# Altium project XPIMU_1V1.PrjPCB
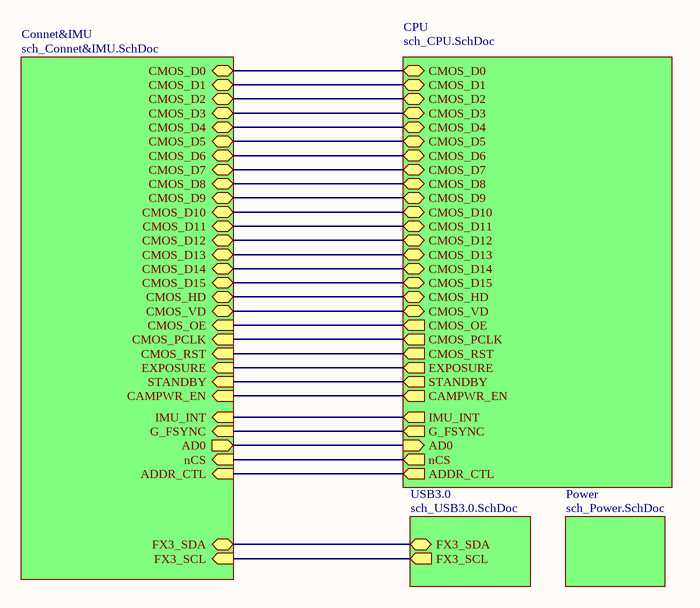
[diagram p0: sch_Top.SchDoc]
5 sheets, 137 parts. Net scope: hierarchical (ports join the sheet entries above them; power ports are global).
Sheets:
  sch_Top.SchDoc
    Connet&IMU = sch_Connet&IMU.SchDoc
    USB3.0 = sch_USB3.0.SchDoc
    CPU = sch_CPU.SchDoc
    Power = sch_Power.SchDoc

## Sheet sch_Top.SchDoc
size A4

### Sub-sheets
Connet&IMU = sch_Connet&IMU.SchDoc: FX3_SCL (in), AD0 (out), nCS (in), STANDBY (in), EXPOSURE (in), CMOS_OE (in), CAMPWR_EN (in), ADDR_CTL (in), CMOS_RST (in), FX3_SDA (bidir), CMOS_HD (bidir), CMOS_PCLK (in), CMOS_VD (bidir), CMOS_D0 (bidir), CMOS_D1 (bidir), CMOS_D2 (bidir), CMOS_D3 (bidir), CMOS_D4 (bidir), CMOS_D5 (bidir), CMOS_D6 (bidir), CMOS_D7 (bidir), CMOS_D8 (bidir), CMOS_D9 (bidir), CMOS_D10 (bidir), CMOS_D11 (bidir), CMOS_D12 (bidir), CMOS_D13 (bidir), CMOS_D14 (bidir), CMOS_D15 (bidir), IMU_INT (in), G_FSYNC (in)
CPU = sch_CPU.SchDoc: AD0 (in), ADDR_CTL (out), CAMPWR_EN (out), CMOS_D0 (bidir), CMOS_D1 (bidir), CMOS_D2 (bidir), CMOS_D3 (bidir), CMOS_D4 (bidir), CMOS_D5 (bidir), CMOS_D6 (bidir), CMOS_D7 (bidir), CMOS_D8 (bidir), CMOS_D9 (bidir), CMOS_D10 (bidir), CMOS_D11 (bidir), CMOS_D12 (bidir), CMOS_D13 (bidir), CMOS_D14 (bidir), CMOS_D15 (bidir), CMOS_HD (bidir), CMOS_VD (bidir), CMOS_OE (out), CMOS_PCLK (out), CMOS_RST (out), EXPOSURE (out), IMU_INT (out), G_FSYNC (out), STANDBY (out), nCS (out)
Power = sch_Power.SchDoc: no entries
USB3.0 = sch_USB3.0.SchDoc: FX3_SDA (bidir), FX3_SCL (out)

### Nets
AD0: sheet Connet&IMU/AD0, sheet CPU/AD0
ADDR_CTL: sheet Connet&IMU/ADDR_CTL, sheet CPU/ADDR_CTL
CAMPWR_EN: sheet Connet&IMU/CAMPWR_EN, sheet CPU/CAMPWR_EN
CMOS_D0: sheet Connet&IMU/CMOS_D0, sheet CPU/CMOS_D0
CMOS_D1: sheet Connet&IMU/CMOS_D1, sheet CPU/CMOS_D1
CMOS_D2: sheet Connet&IMU/CMOS_D2, sheet CPU/CMOS_D2
CMOS_D3: sheet Connet&IMU/CMOS_D3, sheet CPU/CMOS_D3
CMOS_D4: sheet Connet&IMU/CMOS_D4, sheet CPU/CMOS_D4
CMOS_D5: sheet Connet&IMU/CMOS_D5, sheet CPU/CMOS_D5
CMOS_D6: sheet Connet&IMU/CMOS_D6, sheet CPU/CMOS_D6
CMOS_D7: sheet Connet&IMU/CMOS_D7, sheet CPU/CMOS_D7
CMOS_D8: sheet Connet&IMU/CMOS_D8, sheet CPU/CMOS_D8
CMOS_D9: sheet Connet&IMU/CMOS_D9, sheet CPU/CMOS_D9
CMOS_D10: sheet Connet&IMU/CMOS_D10, sheet CPU/CMOS_D10
CMOS_D11: sheet Connet&IMU/CMOS_D11, sheet CPU/CMOS_D11
CMOS_D12: sheet Connet&IMU/CMOS_D12, sheet CPU/CMOS_D12
CMOS_D13: sheet Connet&IMU/CMOS_D13, sheet CPU/CMOS_D13
CMOS_D14: sheet Connet&IMU/CMOS_D14, sheet CPU/CMOS_D14
CMOS_D15: sheet Connet&IMU/CMOS_D15, sheet CPU/CMOS_D15
CMOS_HD: sheet Connet&IMU/CMOS_HD, sheet CPU/CMOS_HD
CMOS_OE: sheet Connet&IMU/CMOS_OE, sheet CPU/CMOS_OE
CMOS_PCLK: sheet Connet&IMU/CMOS_PCLK, sheet CPU/CMOS_PCLK
CMOS_RST: sheet Connet&IMU/CMOS_RST, sheet CPU/CMOS_RST
CMOS_VD: sheet Connet&IMU/CMOS_VD, sheet CPU/CMOS_VD
EXPOSURE: sheet Connet&IMU/EXPOSURE, sheet CPU/EXPOSURE
FX3_SCL: sheet Connet&IMU/FX3_SCL, sheet USB3.0/FX3_SCL
FX3_SDA: sheet Connet&IMU/FX3_SDA, sheet USB3.0/FX3_SDA
G_FSYNC: sheet Connet&IMU/G_FSYNC, sheet CPU/G_FSYNC
IMU_INT: sheet Connet&IMU/IMU_INT, sheet CPU/IMU_INT
nCS: sheet Connet&IMU/nCS, sheet CPU/nCS
STANDBY: sheet Connet&IMU/STANDBY, sheet CPU/STANDBY

## Sheet sch_Connet&IMU.SchDoc
size A4
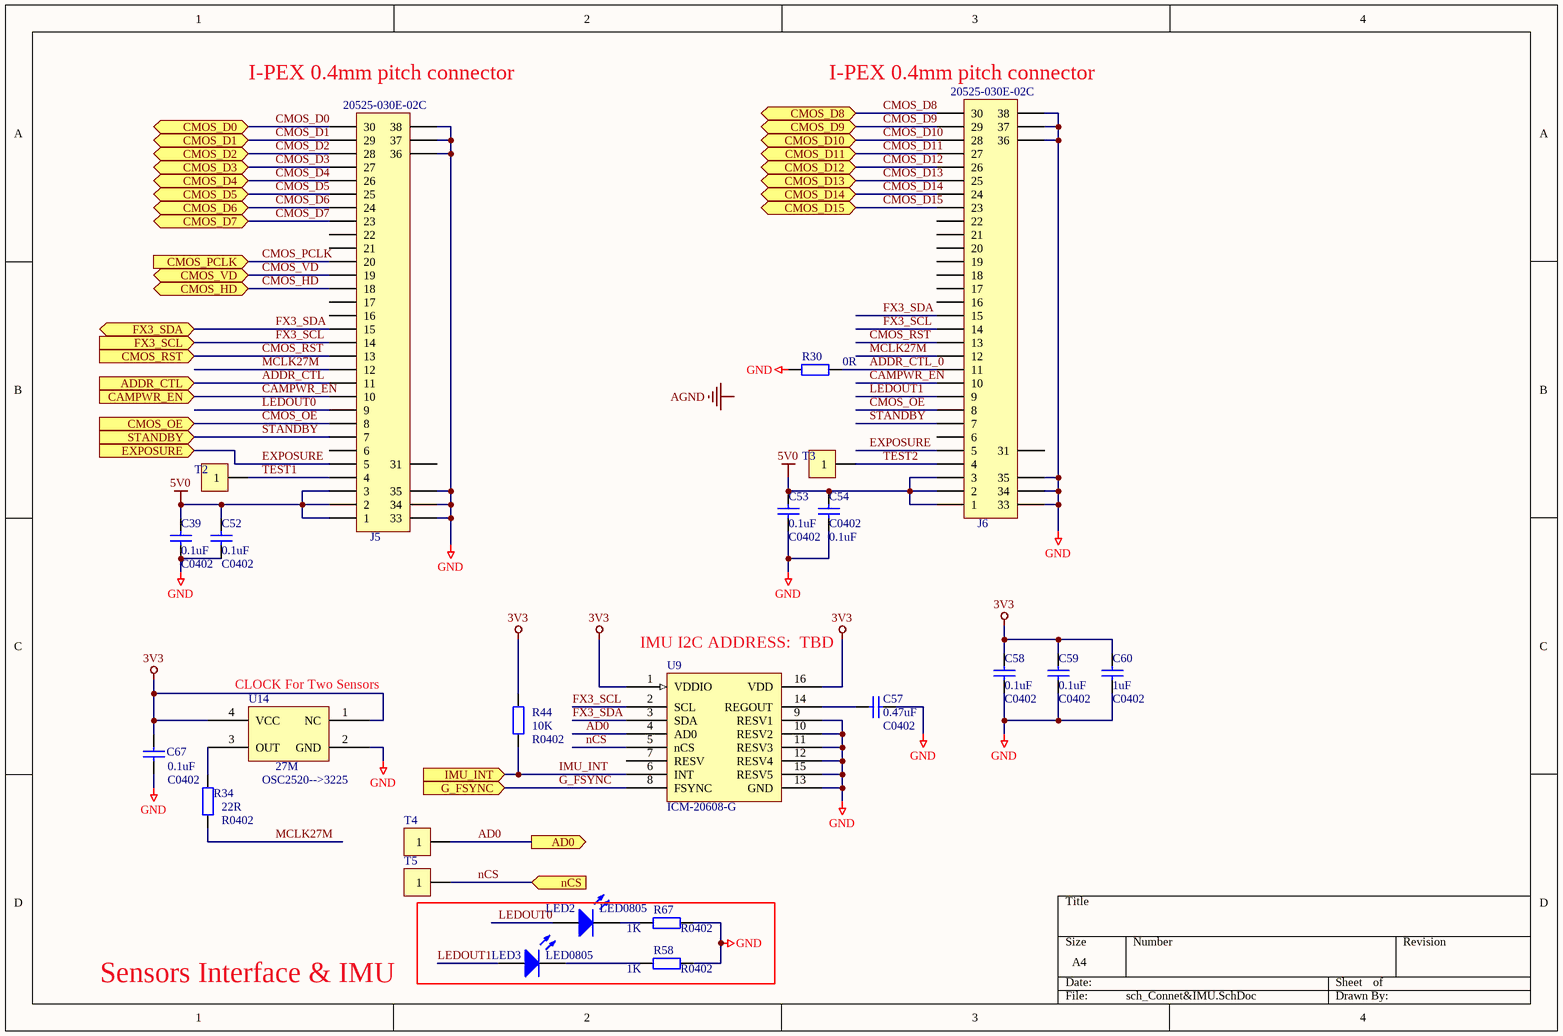
[diagram p1: sch_Connet&IMU.SchDoc]

### Parts
C39  0.1uF  value C0402  [0402C]
C52  0.1uF  value C0402  [0402C]
C53  0.1uF  value C0402  [0402C]
C54  0.1uF  value C0402  [0402C]
C57  0.47uF  value C0402  [0402C]
C58  0.1uF  value C0402  [0402C]
C59  0.1uF  value C0402  [0402C]
C60  1uF  value C0402  [0402C]
C67  0.1uF  value C0402  [0402C]
J5  20525-030E-02C  [HSA30_P40L196W42H10_20525]
J6  20525-030E-02C  [HSA30_P40L196W42H10_20525]
LED2  LED0805  [LED0805A_L210W100H60]
LED3  LED0805  [LED0805A_L210W100H60]
R30  0R  [0402R]
R34  22R  value R0402  [0402R]
R44  10K  value R0402  [0402R]
R58  1K  value R0402  [0402R]
R67  1K  value R0402  [0402R]
T2  CON1  [PAD_TP_D1.2]  (value not drawn)
T3  CON1  [PAD_TP_D1.2]  (value not drawn)
T4  CON1  [PAD_TP_D1.2]  (value not drawn)
T5  CON1  [PAD_TP_D1.2]  (value not drawn)
U9  ICM-20608-G  [LGA16_P50L30W30H08]
U14  OSC2520-->3225  [XTAL_3225]

### Ports
AD0 (out), ADDR_CTL (in), CAMPWR_EN (in), CMOS_D0 (bidir), CMOS_D1 (bidir), CMOS_D2 (bidir), CMOS_D3 (bidir), CMOS_D4 (bidir), CMOS_D5 (bidir), CMOS_D6 (bidir), CMOS_D7 (bidir), CMOS_D8 (bidir), CMOS_D9 (bidir), CMOS_D10 (bidir), CMOS_D11 (bidir), CMOS_D12 (bidir), CMOS_D13 (bidir), CMOS_D14 (bidir), CMOS_D15 (bidir), CMOS_HD (bidir), CMOS_OE (in), CMOS_PCLK (in), CMOS_RST (in), CMOS_VD (bidir), EXPOSURE (in), FX3_SCL (in), FX3_SDA (bidir), G_FSYNC (in), IMU_INT (in), nCS (in), STANDBY (in)

### Nets
3V3: C58.2 C59.2 C60.2 C67.2 R44.2 U9.1(VDDIO) U9.16(VDD) U14.1(NC) U14.4(VCC)
5V0: C39.2 C52.2 C53.2 C54.2 J5.1 J5.2 J5.3 J6.1 J6.2 J6.3
GND: C39.1 C52.1 C53.1 C54.1 C57.1 C58.1 C59.1 C60.1 C67.1 J5.33 J5.34 J5.35 J5.36 J5.37 J5.38 J6.33 J6.34 J6.35 J6.36 J6.37 J6.38 R30.2 R58.1 R67.1 U9.9(RESV1) U9.10(RESV2) U9.11(RESV3) U9.12(RESV4) U9.13(GND) U9.15(RESV5) U14.2(GND)
AD0: T4.1 U9.4(AD0) ; port AD0
ADDR_CTL: J5.11 ; port ADDR_CTL
ADDR_CTL_0: J6.11 R30.1
CAMPWR_EN: J5.10 J6.10 ; port CAMPWR_EN
CMOS_D0: J5.30 ; port CMOS_D0
CMOS_D1: J5.29 ; port CMOS_D1
CMOS_D2: J5.28 ; port CMOS_D2
CMOS_D3: J5.27 ; port CMOS_D3
CMOS_D4: J5.26 ; port CMOS_D4
CMOS_D5: J5.25 ; port CMOS_D5
CMOS_D6: J5.24 ; port CMOS_D6
CMOS_D7: J5.23 ; port CMOS_D7
CMOS_D8: J6.30 ; port CMOS_D8
CMOS_D9: J6.29 ; port CMOS_D9
CMOS_D10: J6.28 ; port CMOS_D10
CMOS_D11: J6.27 ; port CMOS_D11
CMOS_D12: J6.26 ; port CMOS_D12
CMOS_D13: J6.25 ; port CMOS_D13
CMOS_D14: J6.24 ; port CMOS_D14
CMOS_D15: J6.23 ; port CMOS_D15
CMOS_HD: J5.18 ; port CMOS_HD
CMOS_OE: J5.8 J6.8 ; port CMOS_OE
CMOS_PCLK: J5.20 ; port CMOS_PCLK
CMOS_RST: J5.13 J6.13 ; port CMOS_RST
CMOS_VD: J5.19 ; port CMOS_VD
EXPOSURE: J5.5 J6.5 ; port EXPOSURE
FX3_SCL: J5.14 J6.14 U9.2(SCL) ; port FX3_SCL
FX3_SDA: J5.15 J6.15 U9.3(SDA) ; port FX3_SDA
G_FSYNC: U9.8(FSYNC) ; port G_FSYNC
IMU_INT: R44.1 U9.6(INT) ; port IMU_INT
LEDOUT0: J5.9 LED2.1(A)
LEDOUT1: J6.9 LED3.1(A)
MCLK27M: J5.12 J6.12 R34.1
nCS: T5.1 U9.5(nCS) ; port nCS
STANDBY: J5.7 J6.7 ; port STANDBY
TEST1: J5.4 T2.1
TEST2: J6.4 T3.1
NetC57_2: C57.2 U9.14(REGOUT)
NetLED2_2: LED2.2(K) R67.2
NetLED3_2: LED3.2(K) R58.2
NetR34_2: R34.2 U14.3(OUT)

Not connected (* = marked no-connect by the designer): J5 6 16 17 21 22 31; J6 6 16 17 18 19 20 21 22 31; U9 7(RESV)

### Notes on the sheet
- (near J5) I-PEX 0.4mm pitch connector
- (near J6) I-PEX 0.4mm pitch connector
- (near U9) IMU I2C ADDRESS:  TBD
- (near U14) CLOCK For Two Sensors
- (near U14) 27M
- Sensors Interface & IMU
- Labels drawn without touching a wire or pin: AGND

### Library data of the parts
C39 C52-C54 C57-C60 C67 = Cap: Capacitor; Published: 8-Jun-2000; LatestRevisionDate: 17-Jul-2002; LatestRevisionNote: Re-released for DXP Platform.; PackageReference: RAD-0.3; Publisher: Altium Limited
LED2 LED3 = LED: 发光二级管
R30 R34 R44 R58 R67 = Res2: Resistor; Published: 8-Jun-2000; LatestRevisionDate: 17-Jul-2002; LatestRevisionNote: Re-released for DXP Platform.; PackageReference: AXIAL-0.4; Publisher: Altium Limited
  R30: Value: 0R
T2-T5 = CON1: Connector
U14 = XTAL-SPXO: Simple Package Xtal Oscillator

## Sheet sch_USB3.0.SchDoc
size A4
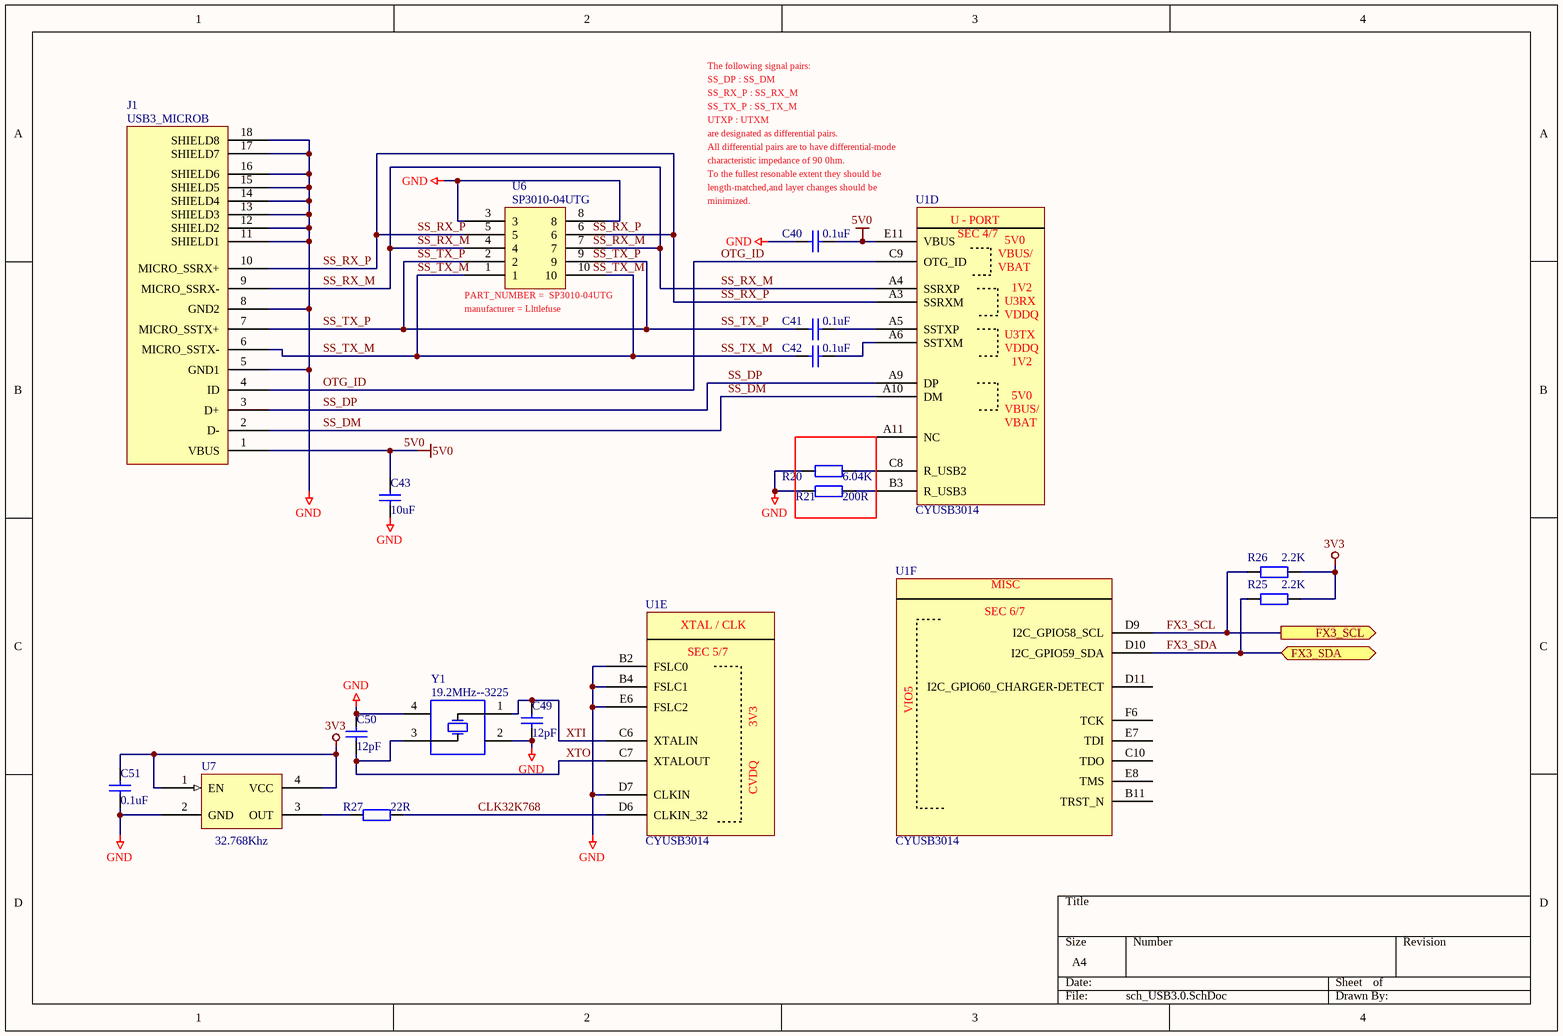
[diagram p2: sch_USB3.0.SchDoc]

### Parts
C40  0.1uF  [0402C]
C41  0.1uF  [0402C]
C42  0.1uF  [0402C]
C43  10uF  [0805C]
C49  12pF  [0402C]
C50  12pF  [0402C]
C51  0.1uF  [0402C]
J1  USB3_MICROB  [USB3_BA_P65L130W51H28]
R20  6.04K  [0402R]
R21  200R  [0402R]
R25  2.2K  [0402R]
R26  2.2K  [0402R]
R27  22R  [0402R]
U1  CYUSB3014  [FBGA121_P80L100W100H11]  (parts D,E,F of 7)
U6  SP3010-04UTG  [UDFN10_SON_P50L25W10H55]
U7  XTAL-3225  [XTAL_3225]  (value not drawn)
Y1  19.2MHz--3225  [XTAL_3225]

### Ports
FX3_SCL (out), FX3_SDA (bidir)

### Nets
3V3: C51.2 R25.1 R26.1 U7.1(EN) U7.4(VCC)
5V0: C40.1 C43.2 J1.1(VBUS) U1.E11(VBUS)
GND: C40.2 C43.1 C49.1 C50.2 C51.1 J1.5(GND1) J1.8(GND2) J1.11(SHIELD1) J1.12(SHIELD2) J1.13(SHIELD3) J1.14(SHIELD4) J1.15(SHIELD5) J1.16(SHIELD6) J1.17(SHIELD7) J1.18(SHIELD8) R20.2 R21.2 U1.B2(FSLC0) U1.B4(FSLC1) U1.D7(CLKIN) U1.E6(FSLC2) U6.3 U6.8 U7.2(GND) Y1.2 Y1.4
CLK32K768: R27.1 U1.D6(CLKIN_32)
FX3_SCL: R26.2 U1.D9(I2C_GPIO58_SCL) ; port FX3_SCL
FX3_SDA: R25.2 U1.D10(I2C_GPIO59_SDA) ; port FX3_SDA
OTG_ID: J1.4(ID) U1.C9(OTG_ID)
SS_DM: J1.2(D-) U1.A10(DM)
SS_DP: J1.3(D+) U1.A9(DP)
SS_RX_M: J1.9(MICRO_SSRX-) U1.A4(SSRXP) U6.4 U6.7
SS_RX_P: J1.10(MICRO_SSRX+) U1.A3(SSRXM) U6.5 U6.6
SS_TX_M: C42.2 J1.6(MICRO_SSTX-) U6.1 U6.10
SS_TX_P: C41.2 J1.7(MICRO_SSTX+) U6.2 U6.9
XTI: C49.2 U1.C6(XTALIN) Y1.1
XTO: C50.1 U1.C7(XTALOUT) Y1.3
NetC41_1: C41.1 U1.A5(SSTXP)
NetC42_1: C42.1 U1.A6(SSTXM)
NetR20_1: R20.1 U1.C8(R_USB2)
NetR21_1: R21.1 U1.B3(R_USB3)
NetR27_2: R27.2 U7.3(OUT)

Not connected (* = marked no-connect by the designer): U1 A11(NC) B11(TRST_N) C10(TDO) D11(I2C_GPIO60_CHARGER-DETECT) E7(TDI) E8(TMS) F6(TCK)

### Notes on the sheet
- The following signal pairs:
- SS_DP : SS_DM
- SS_RX_P : SS_RX_M
- SS_TX_P : SS_TX_M
- UTXP : UTXM
- are designated as differential pairs.
- All differential pairs are to have differential-mode
- characteristic impedance of 90 0hm.
- To the fullest resonable extent they should be
- length-matched,and layer changes should be
- minimized.
- (near U6) PART_NUMBER =  SP3010-04UTG
- (near U6) manufacturer = Llttlefuse
- (near U7) 32.768Khz
- Labels drawn without touching a wire or pin: SS_RX_M, SS_RX_P, SS_TX_M, SS_TX_P
- (in symbol CYUSB3014, part D) U - PORT; SEC 4/7; 5V0; VBUS/; 1V2; U3RX; VDDQ; U3TX
- (in symbol CYUSB3014, part E) XTAL / CLK; SEC 5/7; 3V3; CVDQ
- (in symbol CYUSB3014, part F) MISC; SEC 6/7

### Library data of the parts
C40-C43 C49-C51 = Cap: Capacitor; Published: 8-Jun-2000; LatestRevisionDate: 17-Jul-2002; LatestRevisionNote: Re-released for DXP Platform.; PackageReference: RAD-0.3; Publisher: Altium Limited
  C40-C42 C51: Value: 0.1uF
  C43: Value: 10uF
R20 = Resistor: Value: 43; Published: 8-Jun-2000; LatestRevisionDate: 17-Jul-2002; LatestRevisionNote: Re-released for DXP Platform.; PackageReference: AXIAL-0.4; Publisher: Altium Limited
R21 R25-R27 = Resistor: Published: 8-Jun-2000; LatestRevisionDate: 17-Jul-2002; LatestRevisionNote: Re-released for DXP Platform.; PackageReference: AXIAL-0.4; Publisher: Altium Limited
U7 = XTAL.
Y1 = XTAL: Crystal Oscillator

## Sheet sch_CPU.SchDoc
size A4
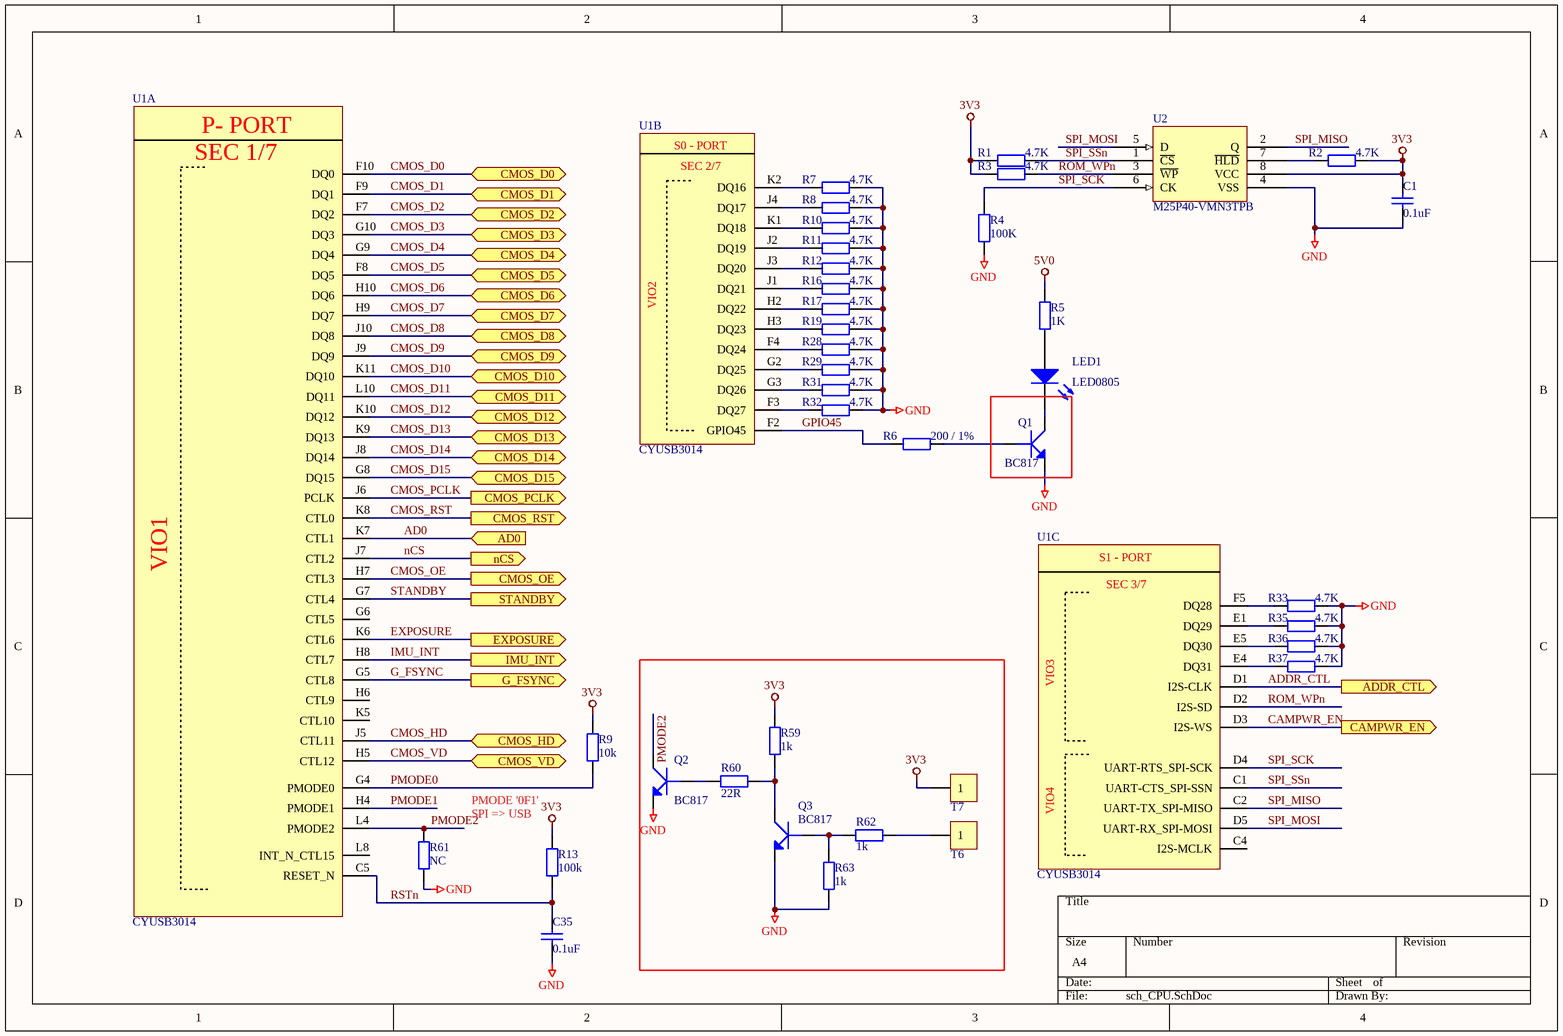
[diagram p3: sch_CPU.SchDoc]

### Parts
C1  0.1uF  [0402C]
C35  0.1uF  [0402C]
LED1  LED0805  [LED0805A_L210W100H60]
Q1  BC817  [SOT-23L]
Q2  BC817  [SOT-23L]
Q3  BC817  [SOT-23L]
R1  4.7K  [0402R]
R2  4.7K  [0402R]
R3  4.7K  [0402R]
R4  100K  [0402R]
R5  1K  [0402R]
R6  value 200 / 1%  [0402R]  (hidden comment: 200R)
R7  4.7K  [0402R]
R8  4.7K  [0402R]
R9  10K  [0402R]
R10  4.7K  [0402R]
R11  4.7K  [0402R]
R12  4.7K  [0402R]
R13  100K  [0402R]
R16  4.7K  [0402R]
R17  4.7K  [0402R]
R19  4.7K  [0402R]
R28  4.7K  [0402R]
R29  4.7K  [0402R]
R31  4.7K  [0402R]
R32  4.7K  [0402R]
R33  4.7K  [0402R]
R35  4.7K  [0402R]
R36  4.7K  [0402R]
R37  4.7K  [0402R]
R59  1K  [0402R]
R60  22R  [0402R]
R61  NC  [0805R]
R62  1k  [0402R]
R63  1k  [0402R]
T6  CON1  [PAD_TP_D1.2]  (value not drawn)
T7  CON1  [PAD_TP_D1.2]  (value not drawn)
U1  CYUSB3014  [FBGA121_P80L100W100H11]  (parts A,B,C of 7)
U2  M25P40-VMN3TPB  [SO8N_P127L50W40W62H17]

### Ports
AD0 (in), ADDR_CTL (out), CAMPWR_EN (out), CMOS_D0 (bidir), CMOS_D1 (bidir), CMOS_D2 (bidir), CMOS_D3 (bidir), CMOS_D4 (bidir), CMOS_D5 (bidir), CMOS_D6 (bidir), CMOS_D7 (bidir), CMOS_D8 (bidir), CMOS_D9 (bidir), CMOS_D10 (bidir), CMOS_D11 (bidir), CMOS_D12 (bidir), CMOS_D13 (bidir), CMOS_D14 (bidir), CMOS_D15 (bidir), CMOS_HD (bidir), CMOS_OE (out), CMOS_PCLK (out), CMOS_RST (out), CMOS_VD (bidir), EXPOSURE (out), G_FSYNC (out), IMU_INT (out), nCS (out), STANDBY (out)

### Nets
3V3: C1.2 R1.1 R2.2 R3.1 R9.1 R13.1 R59.2 T7.1 U2.8(VCC)
5V0: R5.1
GND: C1.1 C35.1 Q1.2(E) Q2.2(E) Q3.2(E) R4.1 R7.2 R8.2 R10.2 R11.2 R12.2 R16.2 R17.2 R19.2 R28.2 R29.2 R31.2 R32.2 R33.2 R35.2 R36.2 R37.2 R61.1 R63.2 U2.4(VSS)
AD0: U1.K7(CTL1) ; port AD0
ADDR_CTL: U1.D1(I2S-CLK) ; port ADDR_CTL
CAMPWR_EN: U1.D3(I2S-WS) ; port CAMPWR_EN
CMOS_D0: U1.F10(DQ0) ; port CMOS_D0
CMOS_D1: U1.F9(DQ1) ; port CMOS_D1
CMOS_D2: U1.F7(DQ2) ; port CMOS_D2
CMOS_D3: U1.G10(DQ3) ; port CMOS_D3
CMOS_D4: U1.G9(DQ4) ; port CMOS_D4
CMOS_D5: U1.F8(DQ5) ; port CMOS_D5
CMOS_D6: U1.H10(DQ6) ; port CMOS_D6
CMOS_D7: U1.H9(DQ7) ; port CMOS_D7
CMOS_D8: U1.J10(DQ8) ; port CMOS_D8
CMOS_D9: U1.J9(DQ9) ; port CMOS_D9
CMOS_D10: U1.K11(DQ10) ; port CMOS_D10
CMOS_D11: U1.L10(DQ11) ; port CMOS_D11
CMOS_D12: U1.K10(DQ12) ; port CMOS_D12
CMOS_D13: U1.K9(DQ13) ; port CMOS_D13
CMOS_D14: U1.J8(DQ14) ; port CMOS_D14
CMOS_D15: U1.G8(DQ15) ; port CMOS_D15
CMOS_HD: U1.J5(CTL11) ; port CMOS_HD
CMOS_OE: U1.H7(CTL3) ; port CMOS_OE
CMOS_PCLK: U1.J6(PCLK) ; port CMOS_PCLK
CMOS_RST: U1.K8(CTL0) ; port CMOS_RST
CMOS_VD: U1.H5(CTL12) ; port CMOS_VD
EXPOSURE: U1.K6(CTL6) ; port EXPOSURE
G_FSYNC: U1.G5(CTL8) ; port G_FSYNC
GPIO45: R6.1 U1.F2(GPIO45)
IMU_INT: U1.H8(CTL7) ; port IMU_INT
nCS: U1.J7(CTL2) ; port nCS
PMODE0: R9.2 U1.G4(PMODE0)
PMODE1: U1.H4(PMODE1)
PMODE2: Q2.3(C) R61.2 U1.L4(PMODE2)
ROM_WPn: R3.2 U1.D2(I2S-SD) U2.3(~{WP})
RSTn: C35.2 R13.2 U1.C5(RESET_N)
SPI_MISO: U1.C2(UART-TX_SPI-MISO) U2.2(Q)
SPI_MOSI: U1.D5(UART-RX_SPI-MOSI) U2.5(D)
SPI_SCK: R4.2 U1.D4(UART-RTS_SPI-SCK) U2.6(CK)
SPI_SSn: R1.2 U1.C1(UART-CTS_SPI-SSN) U2.1(~{CS})
STANDBY: U1.G7(CTL4) ; port STANDBY
NetLED1_1: LED1.1(A) R5.2
NetLED1_2: LED1.2(K) Q1.3(C)
NetQ1_1: Q1.1(B) R6.2
NetQ2_1: Q2.1(B) R60.1
NetQ3_1: Q3.1(B) R62.2 R63.1
NetQ3_3: Q3.3(C) R59.1 R60.2
NetR2_1: R2.1 U2.7(~{HLD})
NetR7_1: R7.1 U1.K2(DQ16)
NetR8_1: R8.1 U1.J4(DQ17)
NetR10_1: R10.1 U1.K1(DQ18)
NetR11_1: R11.1 U1.J2(DQ19)
NetR12_1: R12.1 U1.J3(DQ20)
NetR16_1: R16.1 U1.J1(DQ21)
NetR17_1: R17.1 U1.H2(DQ22)
NetR19_1: R19.1 U1.H3(DQ23)
NetR28_1: R28.1 U1.F4(DQ24)
NetR29_1: R29.1 U1.G2(DQ25)
NetR31_1: R31.1 U1.G3(DQ26)
NetR32_1: R32.1 U1.F3(DQ27)
NetR33_1: R33.1 U1.F5(DQ28)
NetR35_1: R35.1 U1.E1(DQ29)
NetR36_1: R36.1 U1.E5(DQ30)
NetR37_1: R37.1 U1.E4(DQ31)
NetR62_1: R62.1 T6.1

Not connected (* = marked no-connect by the designer): U1 C4(I2S-MCLK) G6(CTL5) H6(CTL9) K5(CTL10) L8(INT_N_CTL15)

### Notes on the sheet
- PMODE '0F1'
- SPI => USB
- (in symbol CYUSB3014, part A) P- PORT; SEC 1/7; VIO1
- (in symbol CYUSB3014, part B) S0 - PORT; SEC 2/7
- (in symbol CYUSB3014, part C) S1 - PORT; SEC 3/7

### Library data of the parts
C1 C35 = Cap: Capacitor; Published: 8-Jun-2000; LatestRevisionDate: 17-Jul-2002; LatestRevisionNote: Re-released for DXP Platform.; PackageReference: RAD-0.3; Publisher: Altium Limited; Value: 0.1uF
LED1 = LED: 发光二级管
Q1-Q3 = NPN: NPN Transistor
R1-R13 R16 R17 R19 R28 R29 R31-R33 R35-R37 R59 R61-R63 = Resistor: Published: 8-Jun-2000; LatestRevisionDate: 17-Jul-2002; LatestRevisionNote: Re-released for DXP Platform.; PackageReference: AXIAL-0.4; Publisher: Altium Limited
  R1-R3 R7 R8 R10-R12 R16 R17 R19 R28 R29 R31-R33 R35-R37: Value: 4.7K
  R4: Value: 100K
  R5: Value: 1K
  R9: Value: 10k
  R13: Value: 100k
  R59 R62 R63: Value: 1k
  R61: Value: NC
R60 = Resistor: Value: 10k; Published: 8-Jun-2000; LatestRevisionDate: 17-Jul-2002; LatestRevisionNote: Re-released for DXP Platform.; PackageReference: AXIAL-0.4; Publisher: Altium Limited
T6 T7 = CON1: Connector

## Sheet sch_Power.SchDoc
size A4
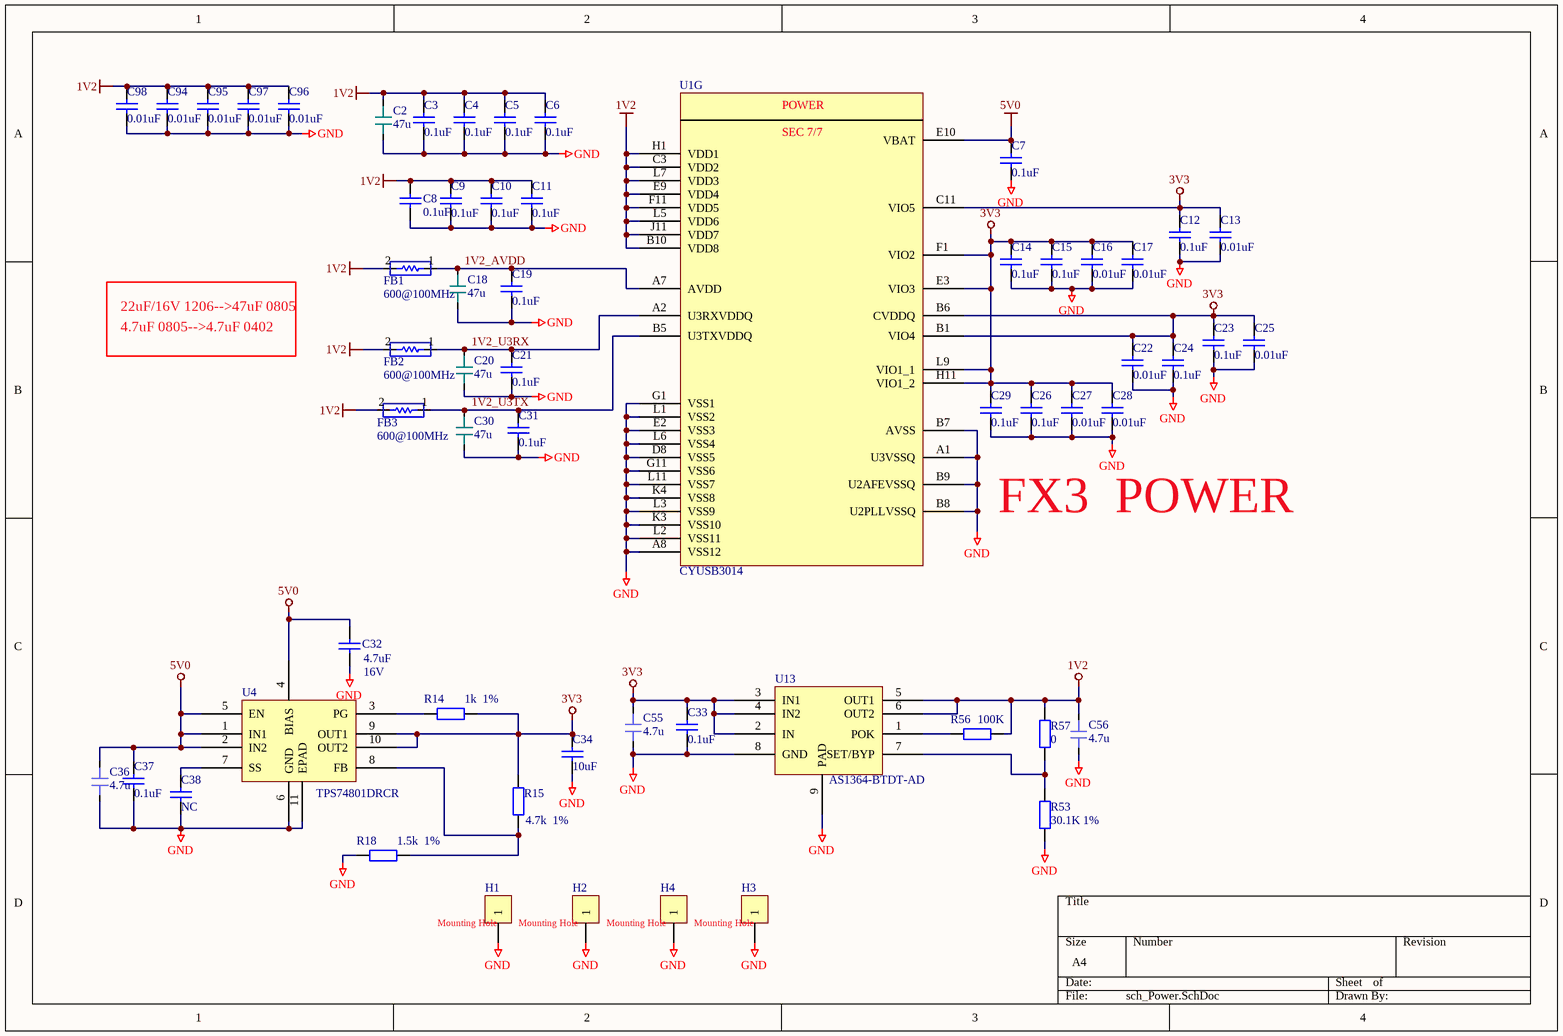
[diagram p4: sch_Power.SchDoc]

### Parts
C2  47u  [0805C]
C3  0.1uF  [0402C]
C4  0.1uF  [0402C]
C5  0.1uF  [0402C]
C6  0.1uF  [0402C]
C7  0.1uF  [0402C]
C8  0.1uF  [0402C]
C9  0.1uF  [0402C]
C10  0.1uF  [0402C]
C11  0.1uF  [0402C]
C12  0.1uF  [0402C]
C13  0.01uF  [0402C]
C14  0.1uF  [0402C]
C15  0.1uF  [0402C]
C16  0.01uF  [0402C]
C17  0.01uF  [0402C]
C18  47u  [0805C]
C19  0.1uF  [0402C]
C20  47u  [0805C]
C21  0.1uF  [0402C]
C22  0.01uF  [0402C]
C23  0.1uF  [0402C]
C24  0.1uF  [0402C]
C25  0.01uF  [0402C]
C26  0.1uF  [0402C]
C27  0.01uF  [0402C]
C28  0.01uF  [0402C]
C29  0.1uF  [0402C]
C30  47u  [0805C]
C31  0.1uF  [0402C]
C32  4.7uF  value 16V  [0805C]
C33  0.1uF  [0402C]
C34  10uF  [0805C]
C36  4.7u  [0402C]
C37  0.1uF  [0402C]
C38  NC  [0402C]
C55  4.7u  [0402C]
C56  4.7u  [0402C]
C94  0.01uF  [0402C]
C95  0.01uF  [0402C]
C96  0.01uF  [0402C]
C97  0.01uF  [0402C]
C98  0.01uF  [0402C]
FB1  600@100MHz  [0402R]
FB2  600@100MHz  [0402R]
FB3  600@100MHz  [0402R]
H1  CON1  [PAD_M3_D350_450]  (value not drawn)
H2  CON1  [PAD_M3_D350_450]  (value not drawn)
H3  CON1  [PAD_M3_D350_450]  (value not drawn)
H4  CON1  [PAD_M3_D350_450]  (value not drawn)
R14  value 1k  1%  [0402R]  (hidden comment: 1K)
R15  value 4.7k  1%  [0402R]  (hidden comment: 51K)
R18  value 1.5k  1%  [0402R]  (hidden comment: 1.15K)
R53  value 30.1K 1%  [0402R]  (hidden comment: 30.1K)
R56  100K  [0402R]
R57  value 0  [0402R]  (hidden comment: 0R)
U1  CYUSB3014  [FBGA121_P80L100W100H11]  (part G of 7)
U4  TPS74801DRCR  [SON10_P50L32W32H10_DRC]
U13  AS1364-BTDT-AD  [TDFN8_P65L30W30H08]

### Nets
1V2: C2.1 C3.2 C4.2 C5.2 C6.2 C8.2 C9.2 C10.2 C11.2 C56.1 C94.2 C95.2 C96.2 C97.2 C98.2 FB1.2 FB2.2 FB3.2 R56.1 R57.1 U1.B10(VDD8) U1.C3(VDD2) U1.E9(VDD4) U1.F11(VDD5) U1.H1(VDD1) U1.J11(VDD7) U1.L5(VDD6) U1.L7(VDD3) U13.5(OUT1) U13.6(OUT2)
3V3: C12.2 C13.2 C14.2 C15.2 C16.2 C17.2 C22.2 C23.2 C24.2 C25.2 C26.2 C27.2 C28.2 C29.2 C33.2 C34.2 C55.1 R14.1 R15.1 U1.B1(VIO4) U1.B6(CVDDQ) U1.C11(VIO5) U1.E3(VIO3) U1.F1(VIO2) U1.H11(VIO1_2) U1.L9(VIO1_1) U4.9(OUT1) U4.10(OUT2) U13.2(IN) U13.3(IN1) U13.4(IN2)
5V0: C7.2 C32.1 C36.1 C37.2 U1.E10(VBAT) U4.1(IN1) U4.2(IN2) U4.4(BIAS) U4.5(EN)
GND: C2.2 C3.1 C4.1 C5.1 C6.1 C7.1 C8.1 C9.1 C10.1 C11.1 C12.1 C13.1 C14.1 C15.1 C16.1 C17.1 C18.2 C19.1 C20.2 C21.1 C22.1 C23.1 C24.1 C25.1 C26.1 C27.1 C28.1 C29.1 C30.2 C31.1 C32.2 C33.1 C34.1 C36.2 C37.1 C38.1 C55.2 C56.2 C94.1 C95.1 C96.1 C97.1 C98.1 H1.1 H2.1 H3.1 H4.1 R18.2 R53.2 U1.A1(U3VSSQ) U1.A8(VSS12) U1.B7(AVSS) U1.B8(U2PLLVSSQ) U1.B9(U2AFEVSSQ) U1.D8(VSS5) U1.E2(VSS3) U1.G1(VSS1) U1.G11(VSS6) U1.K3(VSS10) U1.K4(VSS8) U1.L1(VSS2) U1.L2(VSS11) U1.L3(VSS9) U1.L6(VSS4) U1.L11(VSS7) U4.6(GND) U4.11(EPAD) U13.8(GND) U13.9(PAD)
1V2_AVDD: C18.1 C19.2 FB1.1 U1.A7(AVDD)
1V2_U3RX: C20.1 C21.2 FB2.1 U1.A2(U3RXVDDQ)
1V2_U3TX: C30.1 C31.2 FB3.1 U1.B5(U3TXVDDQ)
NetC38_2: C38.2 U4.7(SS)
NetR14_2: R14.2 U4.3(PG)
NetR15_2: R15.2 R18.1 U4.8(FB)
NetR53_1: R53.1 R57.2 U13.7(SET/BYP)
NetR56_2: R56.2 U13.1(POK)

### Notes on the sheet
- 22uF/16V 1206-->47uF 0805
- 4.7uF 0805-->4.7uF 0402
- FX3  POWER
- (near H1) Mounting Hole
- (near H2) Mounting Hole
- (near H4) Mounting Hole
- (near H3) Mounting Hole
- (in symbol CYUSB3014, part G) POWER; SEC 7/7

### Library data of the parts
C2 C18 C20 C30 = cap0805: CC08052B476M5B20D; 元件类别: 贴片电容; 主物料厂家: YAGEO
C3-C17 C19 C21-C29 C31-C34 C37 C38 C94-C98 = Cap: Capacitor; Published: 8-Jun-2000; LatestRevisionDate: 17-Jul-2002; LatestRevisionNote: Re-released for DXP Platform.; PackageReference: RAD-0.3; Publisher: Altium Limited
  C3-C12 C14 C15 C19 C21 C23 C24 C26 C29 C31 C33 C37: Value: 0.1uF
  C13 C16 C17 C22 C25 C27 C28 C94-C98: Value: 0.01uF
  C34: Value: 10uF
  C38: Value: NC
C36 C55 C56 = cap0402: CC0402MRX5R5BB475; 元件类别: 贴片电容; 主物料厂家: YAGEO
H1-H4 = CON1: Connector
R14 R15 R18 R53 R56 R57 = Resistor: Published: 8-Jun-2000; LatestRevisionDate: 17-Jul-2002; LatestRevisionNote: Re-released for DXP Platform.; PackageReference: AXIAL-0.4; Publisher: Altium Limited
  R56: Value: 100K

## Nets that join several sheets
3V3: sch_Connet&IMU (9 pins), sch_USB3.0 (5 pins), sch_CPU (9 pins), sch_Power (31 pins)
5V0: sch_Connet&IMU (10 pins), sch_USB3.0 (C40.1 C43.2 J1.1 U1.E11), sch_CPU (R5.1), sch_Power (9 pins)
GND: sch_Connet&IMU (31 pins), sch_USB3.0 (26 pins), sch_CPU (25 pins), sch_Power (69 pins)
AD0: sch_Connet&IMU (T4.1 U9.4), sch_CPU (U1.K7)
ADDR_CTL: sch_Connet&IMU (J5.11), sch_CPU (U1.D1)
CAMPWR_EN: sch_Connet&IMU (J5.10 J6.10), sch_CPU (U1.D3)
CMOS_D0: sch_Connet&IMU (J5.30), sch_CPU (U1.F10)
CMOS_D1: sch_Connet&IMU (J5.29), sch_CPU (U1.F9)
CMOS_D2: sch_Connet&IMU (J5.28), sch_CPU (U1.F7)
CMOS_D3: sch_Connet&IMU (J5.27), sch_CPU (U1.G10)
CMOS_D4: sch_Connet&IMU (J5.26), sch_CPU (U1.G9)
CMOS_D5: sch_Connet&IMU (J5.25), sch_CPU (U1.F8)
CMOS_D6: sch_Connet&IMU (J5.24), sch_CPU (U1.H10)
CMOS_D7: sch_Connet&IMU (J5.23), sch_CPU (U1.H9)
CMOS_D8: sch_Connet&IMU (J6.30), sch_CPU (U1.J10)
CMOS_D9: sch_Connet&IMU (J6.29), sch_CPU (U1.J9)
CMOS_D10: sch_Connet&IMU (J6.28), sch_CPU (U1.K11)
CMOS_D11: sch_Connet&IMU (J6.27), sch_CPU (U1.L10)
CMOS_D12: sch_Connet&IMU (J6.26), sch_CPU (U1.K10)
CMOS_D13: sch_Connet&IMU (J6.25), sch_CPU (U1.K9)
CMOS_D14: sch_Connet&IMU (J6.24), sch_CPU (U1.J8)
CMOS_D15: sch_Connet&IMU (J6.23), sch_CPU (U1.G8)
CMOS_HD: sch_Connet&IMU (J5.18), sch_CPU (U1.J5)
CMOS_OE: sch_Connet&IMU (J5.8 J6.8), sch_CPU (U1.H7)
CMOS_PCLK: sch_Connet&IMU (J5.20), sch_CPU (U1.J6)
CMOS_RST: sch_Connet&IMU (J5.13 J6.13), sch_CPU (U1.K8)
CMOS_VD: sch_Connet&IMU (J5.19), sch_CPU (U1.H5)
EXPOSURE: sch_Connet&IMU (J5.5 J6.5), sch_CPU (U1.K6)
FX3_SCL: sch_Connet&IMU (J5.14 J6.14 U9.2), sch_USB3.0 (R26.2 U1.D9)
FX3_SDA: sch_Connet&IMU (J5.15 J6.15 U9.3), sch_USB3.0 (R25.2 U1.D10)
G_FSYNC: sch_Connet&IMU (U9.8), sch_CPU (U1.G5)
IMU_INT: sch_Connet&IMU (R44.1 U9.6), sch_CPU (U1.H8)
nCS: sch_Connet&IMU (T5.1 U9.5), sch_CPU (U1.J7)
STANDBY: sch_Connet&IMU (J5.7 J6.7), sch_CPU (U1.G7)